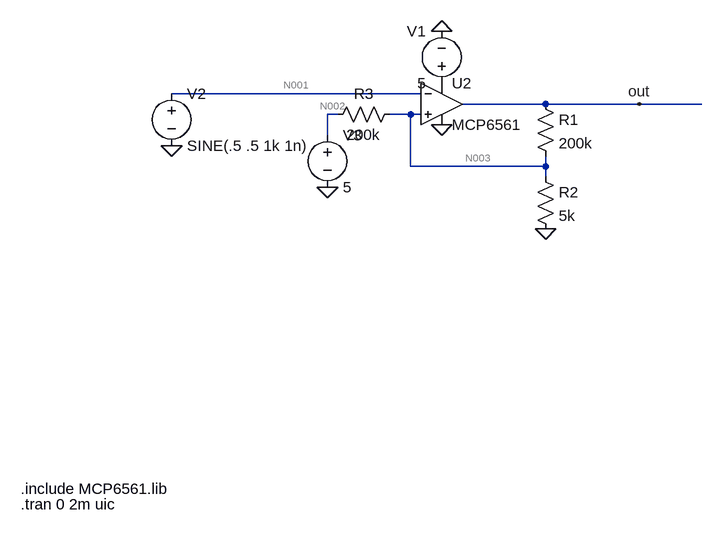
[diagram p0: schematic testing_schmitt_trigger.asc]
testing_schmitt_trigger.asc, the LTspice schematic file:
Version 4.1
SHEET 1 1876 680
WIRE 464 -64 80 -64
WIRE 656 -48 528 -48
WIRE 800 -48 656 -48
WIRE 896 -48 800 -48
WIRE 336 -32 320 -32
WIRE 448 -32 416 -32
WIRE 464 -32 448 -32
WIRE 320 0 320 -32
WIRE 448 48 448 -32
WIRE 656 48 656 32
WIRE 656 48 448 48
WIRE 656 64 656 48
FLAG 496 -16 0
FLAG 496 -160 0
FLAG 656 144 0
FLAG 800 -48 out
FLAG 320 80 0
FLAG 80 16 0
SYMBOL voltage 496 -64 R180
WINDOW 0 24 96 Left 2
WINDOW 3 24 16 Left 2
SYMATTR InstName V1
SYMATTR Value 5
SYMBOL res 640 -64 R0
SYMATTR InstName R1
SYMATTR Value 200k
SYMBOL res 640 48 R0
SYMATTR InstName R2
SYMATTR Value 5k
SYMBOL res 432 -48 R90
WINDOW 0 0 56 VBottom 2
WINDOW 3 32 56 VTop 2
SYMATTR InstName R3
SYMATTR Value 200k
SYMBOL voltage 320 -16 R0
SYMATTR InstName V3
SYMATTR Value 5
SYMBOL OpAmps\\opamp2 496 -112 R0
SYMATTR InstName U2
SYMATTR Value MCP6561
SYMBOL voltage 80 -80 R0
WINDOW 123 0 0 Left 0
WINDOW 39 0 0 Left 0
SYMATTR InstName V2
SYMATTR Value SINE(.5 .5 1k 1n)
TEXT -152 544 Left 2 !.include MCP6561.lib
TEXT -152 568 Left 2 !.tran 0 2m uic

The netlist it stands for:
* testing_schmitt_trigger.asc
V1 P001 0 5
R1 out N003 200k
R2 N003 0 5k
R3 N003 N002 200k
V3 N002 0 5
X§U2 N003 N001 P001 0 out MCP6561  ; pins In+ In- V+ V- OUT
V2 N001 0 SINE(.5 .5 1k 1n)
.include MCP6561.lib
.tran 0 2m uic
.backanno
.end

* Results of the author's LTspice run, read from the files saved beside the schematic
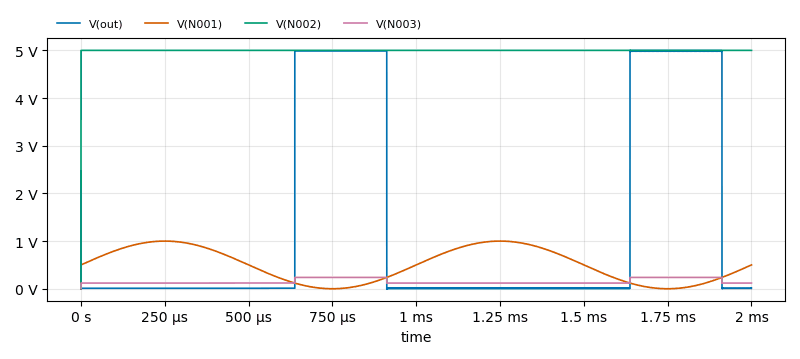
[diagram p1: Transient Analysis of testing_schmitt_trigger.asc, plotted from the saved traces]
* Transient Analysis, 1 run:
*   V(out): min -828.2 µV, max 4.999 V, average 1.376 V, rms 2.613 V, last 15.49 mV
*   V(N001): min 0 V, max 1 V, average 500 mV, rms 612.4 mV, last 500 mV
*   V(N002): min 0 V, max 5 V, average 5 V, rms 5 V, last 5 V
*   V(N003): min 0 V, max 240.1 mV, average 151.8 mV, rms 160.8 mV, last 119.3 mV